# EAGLE schematic ESP_LowPowerSensor (EAGLE 9.6.2)
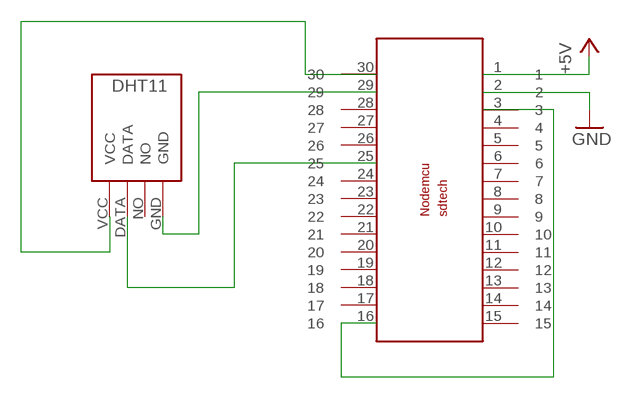
[diagram p0: schematic, sheet 1]

## Parts
U$1  NODEMCUESP8266  [NODEMCUESP8266]
U$2  DHT11  [DHT11]

## Nets
+5V: U$1.1
GND: U$1.2
N$1: U$1.3 U$1.16
N$3: U$1.25 U$2.DATA
N$4: U$1.30 U$2.VCC
N$5: U$1.29 U$2.GND
Unconnected: U$1.4 U$1.5 U$1.6 U$1.7 U$1.8 U$1.9 U$1.10 U$1.11 U$1.12 U$1.13 U$1.14 U$1.15 U$1.17 U$1.18 U$1.19 U$1.20 U$1.21 U$1.22 U$1.23 U$1.24 U$1.26 U$1.27 U$1.28 U$2.NO

## Library data of the parts
U$1 = nodemcu:NODEMCUESP8266: Node Mcu esp8266 12E LIBRARY BY SDTECH ROBOTICS (Shubham Devkar Technology Solutions)
U$2 = DHT11:DHT11: DHT11 Czujnik temperatury i wilgotności